# EasyEDA Pro project luq_board.eprj, board 定板，用于打板
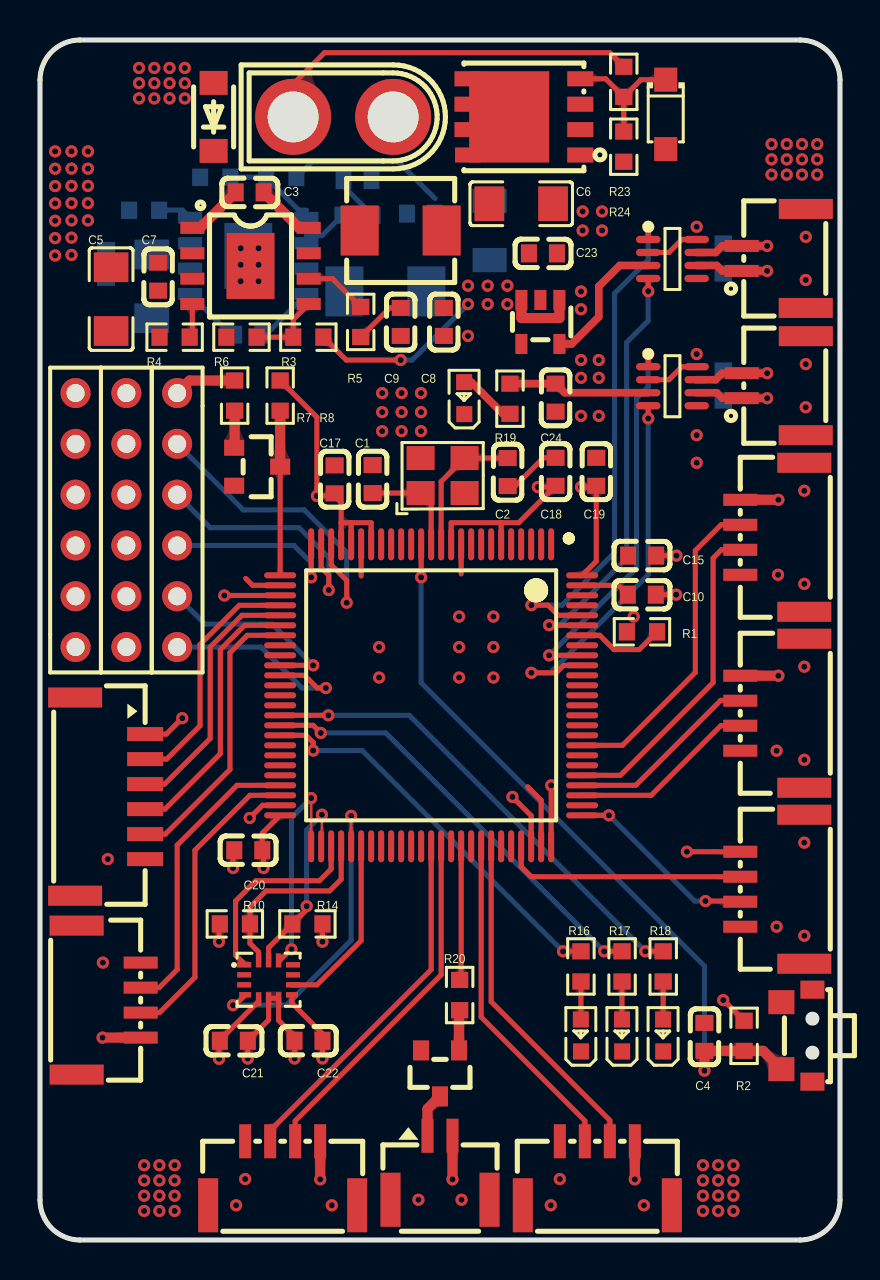
[diagram p3: board, top side]
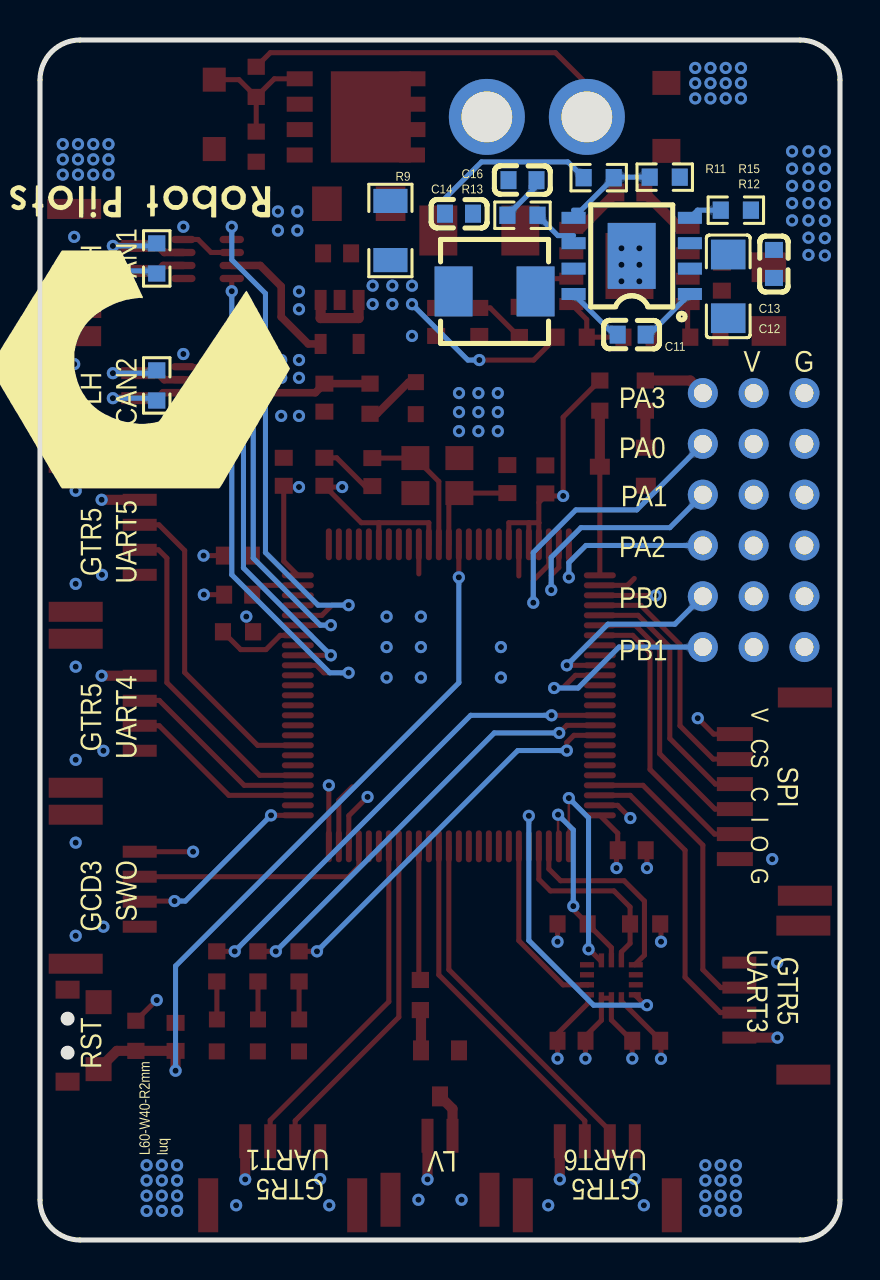
[diagram p4: board, bottom side, seen from below]

Outline 40 x 60 mm; copper layers: Top Layer, vcc, gnd, Bottom Layer. Coordinates in mm from the lower left corner of the outline.
Outline path: 0,58 0,2 arc(0.59,0.59) 2,0 38,0 arc(39.41,0.59) 40,2 40,58 arc(39.41,59.41) 38,60 2,60 arc(0.59,59.41) 0,58
Stack: Top Layer 0.035mm 外层铜厚1oz / Dielectric1 0.2104mm 7628 RC49% 8.6mil / vcc 0.0152mm 内层铜厚 / Dielectric2 1.065mm 1.1mm H/HOZ 含铜 / gnd 0.0152mm 内层铜厚 / Dielectric3 0.2104mm 7628 RC49% 8.6mil / Bottom Layer 0.035mm 外层铜厚1oz

## Design rules (mm)
net CAN2_H: DP2
net CAN2_L: DP2
net CAN1_H: DP1
net CAN1_L: DP1
template: 自定义配置
spacing copperThickness1oz (default): track to track 0.102, other pairs 0.152 to 0.3
spacing copperThickness2oz: track to track 0.203, other pairs 0.152 to 0.3
spacing 6mil: track to track 0.102, other pairs 0.152 to 0.152
track width copperThickness1oz (default): min 0.127, default 0.254, max 2.54
track width copperThickness2oz: min 0.203, default 0.254, max 2.54
track width 10mil: min 0.254, default 0.254, max 2.54
track width 20mil: min 0.508, default 0.508, max 2.54
differential pair differentialPair (default): width min 0.127, default 0.254, max 2.54; gap min 0.152, default 0.152
differential pair err=5mil: width min 0.127, default 0.254, max 2.54; gap min 0.152, default 0.254
via viaSize (default): diameter min 0.5, default 0.61, max 10; hole min 0.3, default 0.305, max 6.299
via 12-24: diameter min 0.5, default 0.61, max 10; hole min 0.3, default 0.305, max 6.299

## Placement (name value [footprint] x y rotation side)
C1  12pF  [C0603]  16.63 38.05 90 top
C2  12pF  [C0603]  23.38 38.4 90 top
C3  100nF  [C0603]  10.48 52.38 180 top
C4  100nF  [C0603]  33.22 10.16 270 top
C5  47uF  [C1206]  3.56 47.04 90 top
C6  47uF  [C1206]  24.06 51.81 180 top
C7  100nF  [C0603]  5.91 48.17 90 top
C8  100nF  [C0603]  20.19 45.9 90 top
C9  3.3nF  [C0603]  18.04 45.9 90 top
C10  10uF  [C0603]  30.09 32.27 180 top
C11  100nF  [C0603]  10.41 45.27 180 bottom
C12  47uF  [C1206]  5.59 47.68 90 bottom
C13  100nF  [C0603]  3.3 48.8 90 bottom
C14  100nF  [C0603]  19.05 51.31 0 bottom
C15  10uF  [C0603]  30.11 34.22 0 top
C16  3.3nF  [C0603]  15.88 52.99 180 bottom
C17  100nF  [C0603]  14.73 38.03 270 top
C18  100nF  [C0603]  25.78 38.41 270 top
C19  100nF  [C0603]  27.81 38.41 270 top
C20  100nF  [C0603]  10.41 19.49 0 top
C21  100nF  [C0603]  9.69 9.96 180 top
C22  100nF  [C0603]  13.42 9.96 0 top
C23  10uF  [C0603]  25.15 49.33 180 top
C24  10uF  [C0603]  25.78 42.12 90 top
CN1  L125WVS-02PW  [CONN-SMD_2P-P1.25_DELON_L125WVS-02PW]  20 3.61 0 top
CN2  XT30U-M  [CONN-TH_XT30U-M]  15.16 56.16 0 top
CN3  GH1.25-2PWBPZ  [CONN-SMD_GH1.25-2PWBPZ]  36.69 49.08 90 top
CN4  GH1.25-2PWBPZ  [CONN-SMD_GH1.25-2PWBPZ]  36.69 42.72 90 top
H1  MF254V-11-06-0743  [HDR-TH_6P-P2.54-V-F_MF254V-11-06-0743]  6.86 36 270 top
H2  MF254V-11-06-0743  [HDR-TH_6P-P2.54-V-F_MF254V-11-06-0743]  4.32 36 90 top
H3  MF254V-11-06-0743  [HDR-TH_6P-P2.54-V-F_MF254V-11-06-0743]  1.78 36 90 top
L1  6.8uH  [IND-SMD_L5.4-W5.2_FXL0530]  18.03 50.47 0 top
L2  6.8uH  [IND-SMD_L5.4-W5.2_FXL0530]  17.27 47.43 0 bottom
LED1  NCD0603R1  [LED0603-RD_RED]  27.05 10.23 90 top
LED2  NCD0603R1  [LED0603-RD_RED]  29.1 10.23 90 top
LED3  NCD0603R1  [LED0603-RD_RED]  31.16 10.23 90 top
LED4  NCD0603G1  [LED0603-RD]  21.21 42.09 90 top
Q1  SS8050  [S8050_SOT-23]  10.86 38.79 180 top
Q2  SS8050  [S8050_SOT-23]  20.13 8.33 90 top
Q3  BSC0702LS  [PG-TDSON-8_L5.0-W6.0-P1.27-BL-EP]  24.2 56.16 90 top
R1  10kΩ  [R0603]  30.1 30.41 180 top
R2  10kΩ  [R0603]  35.21 10.21 90 top
R3  50kΩ  [R0603]  13.42 45.14 0 top
R4  200kΩ  [R0603]  6.73 45.14 0 top
R5  33kΩ  [R0603]  16.03 45.9 90 top
R6  10kΩ  [R0603]  10.07 45.14 0 top
R7  10kΩ  [R0603]  12.01 42.22 90 top
R8  10kΩ  [R0603]  9.73 42.22 90 top
R9  100mΩ  [R1206]  22.48 50.47 270 bottom
R10  10kΩ  [R0603]  9.74 15.8 180 top
R11  50kΩ  [R0603]  12.06 53.12 0 bottom
R12  200kΩ  [R0603]  5.21 51.49 0 bottom
R13  33kΩ  [R0603]  15.88 51.24 180 bottom
R14  10kΩ  [R0603]  13.37 15.8 180 top
R15  10kΩ  [R0603]  8.76 53.14 0 bottom
R16  10kΩ  [R0603]  27.05 13.68 90 top
R17  10kΩ  [R0603]  29.1 13.68 90 top
R18  10kΩ  [R0603]  31.16 13.68 90 top
R19  10kΩ  [R0603]  23.5 42.06 90 top
R20  10kΩ  [R0603]  20.98 12.25 270 top
R21  120Ω  [R0603]  34.16 49.08 270 bottom
R22  120Ω  [R0603]  34.16 42.73 270 bottom
R23  50kΩ  [R0603]  29.19 57.91 90 top
R24  10kΩ  [R0603]  29.19 54.67 90 top
SW1  TS24CA  [SW-SMD_TS24CA]  37.85 10.22 270 top
U1  STM32F407VGT6  [LQFP-100_L14.0-W14.0-P0.50-LS16.0-BL]  19.56 27.23 180 top
U2  GH1.25-4PWBPZ  [CONN-SMD_GH1.25-4PWBPZ]  36.61 35.14 270 top
U3  GH1.25-4PWBPZ  [CONN-SMD_GH1.25-4PWBPZ]  3.43 11.99 90 top
U4  SCT2450QSTER  [ESOP-8_L4.9-W3.9-P1.27-LS6.0-BL-EP]  10.53 48.7 270 top
U5  GH1.25-4PWBPZ  [CONN-SMD_GH1.25-4PWBPZ]  36.61 26.34 270 top
U6  GH1.25-4PWBPZ  [CONN-SMD_GH1.25-4PWBPZ]  27.87 3.34 180 top
U7  SCT2450QSTER  [ESOP-8_L4.9-W3.9-P1.27-LS6.0-BL-EP]  10.41 49.2 90 bottom
U8  GH1.25-4PWBPZ  [CONN-SMD_GH1.25-4PWBPZ]  36.61 17.54 270 top
U9  GH1.25-4PWBPZ  [CONN-SMD_GH1.25-4PWBPZ]  12.13 3.34 180 top
U10  BMI270  [LGA-14_L3.0-W2.5-P0.50-BR]  11.43 13.01 180 top
U11  XC6220B331MR  [SOT-23-5_L2.9-W1.6-P0.95-LS2.8-BR]  25.02 45.9 90 top
U12  HC-GH-6PWT  [CONN-SMD_6P-P1.25_HCTL_HC-GH-6PWT]  3.51 22.17 270 top
U13  MAX3051EKA+T  [SOT-23-8_L3.0-W1.7-P0.65-LS2.8-TL]  31.62 49.05 0 top
U14  SMF22A  [SOD-123FL_L2.8-W1.9-LS3.7-RD]  8.68 56.15 90 top
U15  MAX3051EKA+T  [SOT-23-8_L3.0-W1.7-P0.65-LS2.8-TL]  31.62 42.69 0 top
U16  SMF12A  [SOD-123FL_L2.7-W1.8-LS3.7-RD]  31.29 56.28 270 top
X1  25MHz  [OSC-SMD_4P-L3.2-W2.5-BL]  20.13 38.22 0 top

## Footprints (pads in the part's own frame, mm; a bottom-side part is the same pattern mirrored in y, then rotated)
C0603
  rect 0.8x0.9 smd: 1(-0.7,0) 2(0.7,0)
C1206
  rect 1.485x1.728 smd: 1(-1.593,0) 2(1.593,0)
CONN-SMD_2P-P1.25_DELON_L125WVS-02PW
  rect 0.6x1.7 smd: 1(-0.625,1.6) 2(0.625,1.6)
  rect 1x2.7 smd: 3(2.475,-1.6) 4(-2.475,-1.6)
CONN-SMD_6P-P1.25_HCTL_HC-GH-6PWT
  rect 0.7x1.8 smd: 1(-3.125,1.75) 2(-1.875,1.75) 3(-0.625,1.75) 4(0.625,1.75) 5(1.875,1.75) 6(3.125,1.75)
  rect 1x2.7 smd: 7(4.955,-1.75) 8(-4.955,-1.75)
CONN-SMD_GH1.25-2PWBPZ
  rect 0.6x1.7 smd: 1(-0.625,1.602) 2(0.625,1.602)
  rect 1x2.7 smd: 3(2.475,-1.602) 4(-2.475,-1.598)
CONN-SMD_GH1.25-4PWBPZ
  rect 0.6x1.7 smd: 1(-1.875,-1.601) 2(-0.625,-1.601) 3(0.625,-1.601) 4(1.875,-1.601)
  rect 1x2.7 smd: 5(-3.725,1.601) 6(3.725,1.601)
CONN-TH_XT30U-M
  round 3.8 hole 2.54: 1(-2.5,0) 2(2.5,0)
ESOP-8_L4.9-W3.9-P1.27-LS6.0-BL-EP
  rect 0.6x1.2 smd: 1(-1.905,-2.909) 2(-0.635,-2.909) 3(0.635,-2.909) 4(1.905,-2.909) 5(1.905,2.909) 6(0.635,2.909) 7(-0.635,2.909) 8(-1.905,2.909)
  rect 3.3x2.4 smd: 9(0,0)
HDR-TH_6P-P2.54-V-F_MF254V-11-06-0743
  round 1.5 hole 0.9: 1(-6.35,0) 2(-3.81,0) 3(-1.27,0) 4(1.27,0) 5(3.81,0) 6(6.35,0)
IND-SMD_L5.4-W5.2_FXL0530
  rect 1.9x2.5 smd: 1(-2.05,0) 2(2.05,0)
LED0603-RD
  rect 0.8x0.8 smd: 1(-0.799,-0.004) 2(0.799,0.004)
LED0603-RD_RED
  rect 0.8x0.8 smd: 1(-0.799,-0.004) 2(0.799,0.004)
LGA-14_L3.0-W2.5-P0.50-BR
  rect 0.7x0.27 smd: 1(1.22,-0.75) 2(1.22,-0.25) 3(1.22,0.25) 9(-1.22,0.25) 10(-1.22,-0.25) 11(-1.22,-0.75)
  rect 0.6x0.27 smd: 4(1.17,0.75) 8(-1.17,0.75)
  rect 0.27x0.7 smd: 5(0.5,0.97) 6(0,0.97) 7(-0.5,0.97) 12(-0.5,-0.97) 13(0,-0.97) 14(0.5,-0.97)
LQFP-100_L14.0-W14.0-P0.50-LS16.0-BL
  oval 0.3x1.6 smd: 1(-6,-7.55) 2(-5.5,-7.55) 3(-5,-7.55) 4(-4.5,-7.55) 5(-4,-7.55) 6(-3.5,-7.55) 7(-3,-7.55) 8(-2.5,-7.55) 9(-2,-7.55) 10(-1.5,-7.55) 11(-1,-7.55) 12(-0.5,-7.55) 13(0,-7.55) 14(0.5,-7.55) 15(1,-7.55) 16(1.5,-7.55) 17(2,-7.55) 18(2.5,-7.55) 19(3,-7.55) 20(3.5,-7.55) 21(4,-7.55) 22(4.5,-7.55) 23(5,-7.55) 24(5.5,-7.55) 25(6,-7.55) 51(6,7.55) 52(5.5,7.55) 53(5,7.55) 54(4.5,7.55) 55(4,7.55) 56(3.5,7.55) 57(3,7.55) 58(2.5,7.55) 59(2,7.55) 60(1.5,7.55) 61(1,7.55) 62(0.5,7.55) 63(0,7.55) 64(-0.5,7.55) 65(-1,7.55) 66(-1.5,7.55) 67(-2,7.55) 68(-2.5,7.55) 69(-3,7.55) 70(-3.5,7.55) 71(-4,7.55) 72(-4.5,7.55) 73(-5,7.55) 74(-5.5,7.55) 75(-6,7.55)
  oval 1.6x0.3 smd: 26(7.55,-6) 27(7.55,-5.5) 28(7.55,-5) 29(7.55,-4.5) 30(7.55,-4) 31(7.55,-3.5) 32(7.55,-3) 33(7.55,-2.5) 34(7.55,-2) 35(7.55,-1.5) 36(7.55,-1) 37(7.55,-0.5) 38(7.55,0) 39(7.55,0.5) 40(7.55,1) 41(7.55,1.5) 42(7.55,2) 43(7.55,2.5) 44(7.55,3) 45(7.55,3.5) 46(7.55,4) 47(7.55,4.5) 48(7.55,5) 49(7.55,5.5) 50(7.55,6) 76(-7.55,6) 77(-7.55,5.5) 78(-7.55,5) 79(-7.55,4.5) 80(-7.55,4) 81(-7.55,3.5) 82(-7.55,3) 83(-7.55,2.5) 84(-7.55,2) 85(-7.55,1.5) 86(-7.55,1) 87(-7.55,0.5) 88(-7.55,0) 89(-7.55,-0.5) 90(-7.55,-1) 91(-7.55,-1.5) 92(-7.55,-2) 93(-7.55,-2.5) 94(-7.55,-3) 95(-7.55,-3.5) 96(-7.55,-4) 97(-7.55,-4.5) 98(-7.55,-5) 99(-7.55,-5.5) 100(-7.55,-6)
OSC-SMD_4P-L3.2-W2.5-BL
  rect 1.4x1.2 smd: 1(-1.1,-0.875) 2(1.1,-0.875) 3(1.1,0.875) 4(-1.1,0.875)
PG-TDSON-8_L5.0-W6.0-P1.27-BL-EP
  rect 0.75x1.3 smd: 1(-1.905,-2.82) 2(-0.635,-2.82) 3(0.635,-2.82) 4(1.905,-2.82) 5(1.905,2.82) 6(0.635,2.82) 7(-0.635,2.82) 8(-1.905,2.794)
  rect 4.56x4 smd: 8(0,0.737)
R0603
  rect 0.806x0.864 smd: 1(-0.753,0) 2(0.753,0)
R1206
  rect 1.208x1.701 smd: 1(-1.479,0) 2(1.479,0)
S8050_SOT-23
  rect 1x0.8 smd: 1(1.15,-0.823) 2(1.15,1.077) 3(-1.15,0.127)
SOD-123FL_L2.7-W1.8-LS3.7-RD
  rect 1.2x1.15 smd: 1(-1.735,0) 2(1.735,0)
SOD-123FL_L2.8-W1.9-LS3.7-RD
  rect 1.2x1.4 smd: 1(-1.7,0) 2(1.7,0)
SOT-23-5_L2.9-W1.6-P0.95-LS2.8-BR
  rect 1x0.6 smd: 1(1.1,-0.95) 2(1.1,0) 3(1.1,0.95) 4(-1.1,0.95) 5(-1.1,-0.95)
SOT-23-8_L3.0-W1.7-P0.65-LS2.8-TL
  oval 1.222x0.364 smd: 1(-1.211,0.975) 2(-1.211,0.325) 3(-1.211,-0.325) 4(-1.211,-0.975) 5(1.211,-0.975) 6(1.211,-0.325) 7(1.211,0.325) 8(1.211,0.975)
SW-SMD_TS24CA
  rect 0.9x1.2 smd: 1(-2.3,0.775) 2(2.3,0.775)
  rect 1.2x1.3 smd: 3(-1.675,-0.775) 4(1.675,-0.775)

## Nets
As in the schematic.

Pads without a net: U1 1 2 3 4 5 7 8 9 15 16 17 18 33 34 37 38 39 43 44 45 46 57 58 59 60 61 62 65 67 70 71 77 81 82 84 85 86 87 88 89 90 93 97 98; U4 3; U7 3; U10 2 3 10 11; U11 4; U13 5; U15 5

## Via types
v1: diameter 0.61, hole 0.305, Top Layer to Bottom Layer, 197 vias

## Routing (per net, layer and track width the routed paths; a pad name or vN(x,y) marks a point on that pad's centre or on a via; arc(x,y) is an arc through that point)
+3.3V: length 77.5
  Top Layer w0.254: U1.19 16.56,35.86 15.56,35.86 ; v1(7.11,26.09) 6.32,25.3 U12.1 ; 15.06,35.86 15.06,36.88 14.73,37.2 v1(13.84,37.2) 13.84,41.14 R7.2 ; 15.06,35.86 U1.22 ; 15.06,35.86 15.06,35.86 15.56,35.86 ; R10.2 8.95,15.76 v1(8.95,14.92) ; U1.21 15.56,35.86 ; U8.1 v1(32.35,19.41) ; v1(25.56,22.73) U1.75 ; 23.06,35.86 23.93,35.86 25.72,37.65 ; 23.06,35.86 20.56,35.86 U1.11 ; 23.06,35.86 U1.6 ; v1(24.89,37.65) 25.72,37.65 ; 25.72,37.65 C18.2 ; v1(14.12,9.07) 14.12,10.32 12.6,11.84 U10.8 ; 10.93,12.09 10.93,11.94 8.95,9.96 v1(8.95,9.06) ; U1.28 12,32.23 v1(9.21,32.23) ; v1(11.18,18.6) 11.18,19.42 C20.2 11.11,20.34 U1.50 ; 35.21,10.96 34.17,11.99 v1(34.16,11.99) ; U1.100 27.81,33.94 C19.2 27.75,37.65 v1(27.05,37.65) ; v1(14.12,14.92) R14.1
  Top Layer w0.381: U13.3 28.99,48.73 27.94,47.68 27.94,46.16 26.59,44.8 U11.5 ; U15.3 26.23,42.36 C24.2 R19.2
  vcc w0.254: v1(32.35,19.41) 32.35,13.81 v1(34.16,11.99) ; v1(7.11,26.09) 9.53,26.09
  vias: v1(27.05,47.43) v1(27.05,46.54) v1(27.05,44) v1(27.05,43.11) v1(27.94,44) v1(27.94,43.11)
+5V: length 24.3
  Top Layer w0.254: R3.2 15.31,44 v1(18.03,44)
  Top Layer w0.508: v1(14.01,3.03) U9.1 ; v1(20.62,3.03) CN1.2 ; 24.07,47 24.07,46.1 25.97,46.1 U11.1 ; 35.01,37.01 v1(36.92,37.01) ; v1(29.74,3.03) U6.1 ; U5.1 v1(36.92,28.21) ; v1(3.13,10.12) U3.1
  Bottom Layer w0.254: v1(21.4,46.79) 18.61,44 v1(18.03,44)
  vias: v1(21.4,47.72) v1(22.38,47.72) v1(22.38,46.79) v1(23.37,47.72) v1(23.37,46.79)
+5V_PWM: length 8
  Bottom Layer w0.254: R11.2 13.6,53.9 17.92,53.9 19.75,52.08
+24V: length 19.1
  Top Layer w0.254: CN2.1 12.66,57.8 14.22,59.36 28.49,59.36 R23.2
  vias: v1(0.76,54.43) v1(0.76,53.56) v1(0.76,52.7) v1(0.76,51.83) v1(0.76,50.96) v1(0.76,50.09) v1(0.76,49.23) v1(1.58,54.43) v1(1.58,53.57) v1(1.58,52.7) v1(1.58,51.84) v1(1.58,50.98) v1(1.58,50.12) v1(1.58,49.25) v1(2.4,54.43) v1(2.4,53.57) v1(2.4,52.7) v1(2.4,51.84) v1(2.4,50.98)
GND: length 27
  Top Layer w0.254: C2.1 23.75,37.7 25.17,39.11 25.53,39.11 ; U15.8 32.1,43.66 31.45,43.01 U15.2 ; 10.29,33.08 10.63,32.73 U1.27 ; U1.99 28.92,32.73 C10.2 ; 24.38,22.66 25.06,21.99 U1.74 ; U13.8 32.1,50.03 31.45,49.38 U13.2 ; v1(10.39,9.07) 10.39,9.08 C21.1 11.43,11 11.43,12.09 11.93,12.09 11.93,10.99 12.73,10.19 v1(12.73,9.07) ; U1.20 16.06,33.2 ; C20.1 9.65,19.42 v1(9.65,18.6) ; U1.10 21.06,33.31
  vias: v1(3.15,13.87) v1(3.39,19.05) v1(4.95,58.6) v1(4.95,57.84) v1(4.95,57.08) v1(5.21,3.74) v1(5.21,2.98) v1(5.21,2.22) v1(5.21,1.45) v1(5.72,58.6) v1(5.72,57.84) v1(5.72,57.08) v1(5.97,3.74) v1(5.97,2.98) v1(5.97,2.22) v1(5.97,1.45) v1(6.48,58.6) v1(6.48,57.84) v1(6.48,57.08) v1(6.73,3.74) v1(6.73,2.98) v1(6.73,2.22) v1(6.73,1.45) v1(7.24,58.6) v1(7.24,57.84) v1(7.24,57.08) v1(9.81,1.74) v1(10.03,49.59) v1(10.03,48.76) v1(10.03,47.94) v1(10.26,3.05) v1(10.93,49.59) v1(10.93,48.76) v1(10.93,47.94) v1(14.59,1.74) v1(16.95,29.65) v1(16.95,28.12) v1(17.11,42.35) v1(17.11,41.39) v1(17.11,40.44) v1(18.08,42.35) v1(18.08,41.39) v1(18.08,40.44) v1(18.92,2.01) v1(19.05,42.35) v1(19.05,41.39) v1(19.05,40.44) v1(20.96,31.17) v1(20.96,29.65) v1(20.96,28.12) v1(21.08,2.01) v1(21.4,45.2) v1(22.67,31.17) v1(22.67,29.65) v1(22.67,28.12) v1(25.54,1.74) v1(25.99,3.05) v1(27.13,51.43) v1(27.13,50.47) v1(27.05,41.2) v1(27.94,41.2) v1(28.1,51.43) v1(28.1,50.47) v1(29.69,31.17) v1(30.19,1.74) v1(32.83,50.66) v1(32.83,44.3) v1(32.83,40.24) v1(32.83,38.86) v1(33.15,3.74) v1(33.15,2.98) v1(33.15,2.22) v1(33.15,1.45) v1(33.91,3.74) v1(33.91,2.98) v1(33.91,2.22) v1(33.91,1.45) v1(34.67,3.74) v1(34.67,2.98) v1(34.67,2.22) v1(34.67,1.45) v1(36.58,54.79) v1(36.58,54.03) v1(36.58,53.27) v1(36.83,24.46) v1(36.83,15.66) v1(36.9,33.26) v1(37.34,54.79) v1(37.34,54.03) v1(37.34,53.27) v1(38.1,54.79) v1(38.1,54.03) v1(38.1,53.27) v1(38.22,37.46) v1(38.22,32.81) v1(38.22,28.67) v1(38.22,24.01) v1(38.22,19.87) v1(38.22,15.21) v1(38.29,50.16) v1(38.29,48) v1(38.29,43.79) v1(38.29,41.64) v1(38.86,54.79) v1(38.86,54.03) v1(38.86,53.27)
$C3_1: length 3
  Top Layer w0.508: 13.43,50.61 12.96,50.61 C3.1
$C3_2: length 2.9
  Top Layer w0.508: U4.1 8.01,50.61 9.78,52.38
$C9_2: length 2.6
  Top Layer w0.254: R5.1 17.49,46.6 18.03,46.6
$C10_1: length 17.4
  Top Layer w0.254: v1(23.62,22.15) 24.56,21.22 U1.73 ; v1(31.81,32.27) C10.1
  vcc w0.254: v1(23.62,22.15) 31.81,30.34 v1(31.81,32.27)
$C11_1: length 3.1
  Bottom Layer w0.254: U7.8 11.29,45.27 C11.1
$C11_2: length 3.1
  Bottom Layer w0.254: U7.1 9.54,45.27 C11.2
$C15_2: length 29.6
  Top Layer w0.254: U1.49 11.12,21.73 v1(10.48,21.1) ; v1(31.82,34.22) 30.81,34.22
  vcc w0.254: v1(31.82,34.22) 20.77,23.17 12.56,23.17 v1(10.48,21.1)
$C16_2: length 2.5
  Bottom Layer w0.254: R13.1 15.18,52.69 15.18,53.12
$CN1_1: length 2.2
  Top Layer w0.508: Q2.3 19.38,6.56 CN1.1
$LED1_2: length 1.9
  Top Layer w0.254: R16.1 27.05,11.03 LED1.2
$LED2_2: length 1.9
  Top Layer w0.254: R17.1 29.1,12.92 LED2.2
$LED3_2: length 1.9
  Top Layer w0.254: LED3.2 31.16,12.92 R18.1
$LED4_2: length 2.9
  Top Layer w0.381: LED4.2 21.56,42.89 23.15,41.31 23.5,41.31
$Q1_1: length 1.9
  Top Layer w0.254: 9.73,39.64 Q1.1
  Top Layer w0.508: R8.1 9.73,39.64
$Q2_1: length 2
  Top Layer w0.508: R20.2 20.95,11.46 Q2.1
$Q3_4: length 6.7
  Top Layer w0.254: U16.1 30.05,58.02 29.19,57.16 ; 29.19,57.16 R24.2 ; 29.19,57.16 28.28,58.06 Q3.4
$R1_1: length 4.4
  Top Layer w0.254: R1.1 29.96,29.52 28.7,29.52 27.99,30.23 U1.94
$R3_1: length 3.8
  Top Layer w0.254: 13.43,46.8 12.66,46.03 R3.1 R6.2
$R4_2: length 1.7
  Top Layer w0.254: U4.4 7.62,45.27 R4.2
$R5_2: length 3.2
  Top Layer w0.254: R5.2 14.62,48.07 13.43,48.07
$R11_1: length 4.5
  Bottom Layer w0.254: R15.2 11.29,53.14 R11.1 12.94,51.49 13.32,51.49
$R12_2: length 1.7
  Bottom Layer w0.254: R12.2 7.12,51.49 U7.4
$R13_2: length 2.2
  Bottom Layer w0.254: 13.32,50.22 14.11,50.22 R13.2
ADC1_IN8: length 9.9
  Top Layer w0.254: v1(13.66,28.73) U1.35
  Bottom Layer w0.254: H1.5 8.25,30.79 11.6,30.79 v1(13.66,28.73)
ADC1_IN9: length 10.8
  Top Layer w0.254: U1.36 13.23,28.23 13.86,27.6 v1(14.29,27.6)
  Bottom Layer w0.254: v1(14.29,27.6) 13.1,27.6 11.05,29.65 H1.6
CAN1_H: length 5.9
  Top Layer w0.381: v1(36.36,49.7) CN3.2 34.11,49.7 33.78,49.38 U13.7
  Bottom Layer w0.254: v1(36.36,49.7) 34.29,49.7 R21.1
CAN1_L: length 5.9
  Top Layer w0.381: v1(36.36,48.45) CN3.1 34.11,48.45 33.84,48.73 U13.6
  Bottom Layer w0.254: R21.2 34.29,48.45 v1(36.36,48.45)
CAN1_RX: length 21.4
  Top Layer w0.254: v1(25.46,30.74) 25.47,30.73 U1.95 ; U13.4 v1(30.41,47.44)
  Bottom Layer w0.254: v1(25.46,30.74) 25.99,30.74 29.34,34.09 29.34,44.89 30.41,45.96 v1(30.41,47.44)
CAN1_TX: length 25.6
  Top Layer w0.254: U1.96 25.91,31.23 25.4,31.74 v1(24.57,31.74) ; U13.1 v1(30.41,50.66)
  Bottom Layer w0.254: v1(30.41,50.66) 30.41,49.01 28.73,47.33 28.73,34.37 26.1,31.74 v1(24.57,31.74)
CAN2_H: length 5.9
  Top Layer w0.381: v1(36.36,43.34) CN4.2 34.11,43.34 33.78,43.01 U15.7
  Bottom Layer w0.254: R22.1 34.3,43.34 v1(36.36,43.34)
CAN2_L: length 5.9
  Top Layer w0.381: v1(36.36,42.09) 34.11,42.09 33.84,42.36 U15.6
  Bottom Layer w0.254: R22.2 34.28,42.09 v1(36.36,42.09)
CAN2_RX: length 19
  Top Layer w0.254: v1(30.41,41.08) U15.4 ; U1.91 26.18,28.73 25.81,28.36 v1(24.57,28.36)
  Bottom Layer w0.254: v1(30.41,41.08) 30.41,33.26 25.51,28.36 v1(24.57,28.36)
CAN2_TX: length 19.4
  Top Layer w0.254: v1(30.41,44.3) U15.1 ; v1(25.46,29.23) U1.92
  Bottom Layer w0.254: v1(25.46,29.23) 29.83,33.6 29.83,42.08 30.41,42.66 v1(30.41,44.3)
INT_1: length 15.8
  Top Layer w0.127: v1(15.56,21.21) U1.55
  Top Layer w0.254: v1(9.65,11.74) 9.74,11.74 U10.4
  Bottom Layer w0.254: v1(9.65,11.74) 12.32,11.74 15.56,14.98 v1(15.56,21.21)
INT_2: length 9.1
  Top Layer w0.254: 12.6,12.76 12.6,12.76 13.84,12.76 16.06,14.97 U1.56
LASER: length 6.7
  Top Layer w0.254: U1.66 21.06,13.08 R20.1
LED_B: length 19.7
  Top Layer w0.254: U1.42 13.3,25.23 13.66,24.88 v1(13.66,24.47) ; v1(26.15,14.43) R16.2
  Bottom Layer w0.254: v1(26.15,14.43) 16.11,24.47 v1(13.66,24.47)
LED_G: length 21.8
  Top Layer w0.254: U1.41 13.66,25.73 v1(14.04,25.35) ; v1(28.21,14.43) R17.2
  Bottom Layer w0.254: v1(28.21,14.43) 17.29,25.35 v1(14.04,25.35)
LED_R: length 24
  Top Layer w0.254: U1.40 v1(14.42,26.23) ; v1(30.27,14.43) R18.2
  Bottom Layer w0.254: v1(14.42,26.23) 18.46,26.23 v1(30.27,14.43)
NRST: length 37.4
  Top Layer w0.254: U1.14 v1(19.06,33.13)
  Top Layer w0.508: v1(33.22,8.46) C4.2 R2.1 36.16,9.46 SW1.4
  Bottom Layer w0.254: v1(19.06,33.13) 19.06,27.86 33.22,13.7 v1(33.22,8.46)
OSC_1: length 6.9
  Top Layer w0.254: U1.12 20.06,37.92 X1.3 C2.2
OSC_2: length 5.2
  Top Layer w0.254: U1.13 19.56,36.82 X1.1 C1.1
PA3: length 3.1
  Top Layer w0.508: H1.1 7.48,42.97 R8.2
SPI1_CS: length 12.3
  Top Layer w0.254: 5.26,24.05 6.34,24.05 8,25.71 8,29.77 9.96,31.73 U1.29
SPI1_MISO: length 13.6
  Top Layer w0.254: U12.4 6.25,21.55 9.02,24.31 9.02,29.52 10.23,30.73 U1.31
SPI1_MOSI: length 14.3
  Top Layer w0.254: U12.5 6.27,20.3 9.5,23.53 9.5,29.37 10.37,30.23 U1.32
SPI1_SCK: length 12.9
  Top Layer w0.254: U12.3 6.23,22.8 8.51,25.08 8.51,29.65 10.1,31.23 U1.30
SPI2_CS: length 11.3
  Top Layer w0.127: v1(13.56,22.1) U1.51
  Top Layer w0.254: 11.93,13.93 11.94,13.93 12.54,14.53 v1(12.57,14.53)
  Bottom Layer w0.254: v1(13.56,22.1) 12.57,21.11 v1(12.57,14.53)
SPI2_MISO: length 10
  Top Layer w0.254: U1.53 14.56,18.55 13.97,17.96 10.79,17.96 9.78,16.95 9.78,14.24 10.26,13.76
SPI2_MOSI: length 9.7
  Top Layer w0.254: 10.93,13.93 10.93,14.4 10.5,14.83 10.5,16.65 11.3,17.45 14.48,17.45 15.06,18.03 U1.54
SPI2_SCLK: length 10
  Top Layer w0.127: v1(14.1,21.27) 14.1,19.72 U1.52
  Top Layer w0.254: 11.43,13.93 11.43,14.62 R14.2 13.34,16.52 v1(13.34,16.69)
  Bottom Layer w0.254: v1(14.1,21.27) 13.34,20.5 v1(13.34,16.69)
SWCLK: length 9.7
  Top Layer w0.254: U1.76 v1(28.45,21.23) ; U8.3 34.98,16.95 v1(33.27,16.95)
  Bottom Layer w0.254: v1(33.27,16.95) 32.74,16.95 v1(28.45,21.23)
SWDIO: length 12.2
  Top Layer w0.254: U1.72 24.06,18.67 24.56,18.16 U8.2
TIM2_1: length 16.5
  Top Layer w0.254: v1(15.34,31.86) 15.34,32.98 14.56,33.76 U1.23
  Bottom Layer w0.254: v1(15.34,31.86) 15.34,34.38 13.21,36.5 10.16,36.5 H1.2
TIM5_2: length 13
  Top Layer w0.254: v1(14.44,32.5) 14.44,33.24 14.06,33.62 U1.24
  Bottom Layer w0.254: v1(14.44,32.5) 14.44,34.13 12.95,35.62 8.51,35.62 H1.3
TIM5_3: length 9.4
  Top Layer w0.254: v1(13.56,33.13) U1.25
  Bottom Layer w0.254: v1(13.56,33.13) 13.56,33.87 12.7,34.73 H1.4
UART1_R: length 17.2
  Top Layer w0.254: U6.2 28.49,5.98 22.56,11.91 U1.69
UART1_T: length 16.9
  Top Layer w0.254: U1.68 22.06,11.15 27.24,5.96 U6.3
UART3_R: length 15.2
  Top Layer w0.254: U1.48 10.49,22.23 7.75,19.49 7.75,13.14 5.98,11.37 U3.2
UART3_T: length 14.8
  Top Layer w0.254: U3.3 5.96,12.62 6.86,13.52 6.86,19.74 9.85,22.73 U1.47
UART4_R: length 9.7
  Top Layer w0.254: U1.79 29.79,22.73 34.04,26.98 35,26.98 U5.2
UART4_T: length 9.3
  Top Layer w0.254: U1.78 30.56,22.23 34.04,25.71 U5.3
UART5_R: length 16
  Top Layer w0.254: U2.2 34.05,35.76 32.77,34.47 32.77,28.38 29.12,24.73 U1.83
UART5_T: length 16.2
  Top Layer w0.254: U2.3 34.07,34.51 33.66,34.09 33.66,27.87 29.02,23.23 U1.80
UART6_R: length 17.8
  Top Layer w0.254: U9.2 12.76,5.96 20.06,13.26 U1.64
UART6_T: length 18.1
  Top Layer w0.254: U9.3 11.51,5.47 19.56,13.52 U1.63
USART2_RX: length 8.2
  Top Layer w0.254: Q1.3 U1.26
  Top Layer w0.508: R7.1 Q1.3

## Copper pours and planes (outline as drawn; the poured copper is in the pictures)
+3.3V on Top Layer: 25.02,42.12 29.46,42.12 29.46,48.95 26.54,48.95 26.54,45.39 25.02,45.39
+3.3V on vcc: 33.02,48.95 33.02,18.62 8.13,18.62 8.13,42.12 25.02,42.12 25.02,48.95
+3.3V on vcc: 8.13,20.12 14.99,20.12 14.99,8.56 8.13,8.56
+5V on Top Layer: 19.18,46.18 24.36,46.18 24.36,52.91 19.18,52.91
+5V on Bottom Layer: 21.5,50.87 24.4,50.87 24.4,46.22 20.86,46.22 20.86,50.24
+5V on vcc: 24.36,52.91 19.18,52.91 19.18,46.18 -4.06,46.18 -4.06,-4.9 42.93,-4.9 42.93,39.14 35.01,39.14 35.01,10.88 29.07,4.94 10.5,4.94 5.59,9.85 5.59,43.62 24.36,43.62
+5V_PWM on Bottom Layer: 18.41,44.83 18.41,49.94 19.33,50.86 19.33,52.79 23.56,52.79 23.56,51.43 21.37,51.43 19.97,50.03 19.97,44.83
+24V on Top Layer: -0.89,55.05 -0.89,48.44 8.48,48.44 8.48,49.71 6.91,49.71 6.53,50.09 6.53,51.01 9.08,53.56 14.83,53.56 14.86,53.52 14.86,60.7 9.81,60.7 9.81,55.58 9.27,55.05
+24V on Bottom Layer: -0.89,55.05 2.85,55.05 2.85,48.83 -0.89,48.83
+24V on Bottom Layer: 8.13,48.23 8.13,48.97 6.68,48.97 6.68,50.63 -0.63,50.63 -0.63,48.83 4.5,48.83 4.5,48.23
+24V on vcc: -6.8,61.04 -6.8,48.44 14.78,48.44 14.78,61.04
GND on Top Layer: -32.51,92.77 76.71,92.77 76.71,-44.78 -32.51,-44.78
GND on Bottom Layer: -10.41,66.35 49.4,66.35 49.4,-8.58 -10.41,-8.58
GND on gnd: -24.38,82.1 72.01,82.1 72.01,-25.98 -24.38,-25.98
PGND on Top Layer: 15.42,61.77 15.42,53.56 25.47,53.56 25.47,61.77
$C3_1 on Top Layer: 16.99,48.86 16.99,53.08 14.35,53.08 14.35,50.98 12.96,50.98 12.96,50.25 14.35,50.25 14.35,48.86
$C11_1 on Bottom Layer: 14.57,50.03 14.57,48.91 13.81,47.68 12.7,47.68 12.7,46.92 14.16,46.92 14.57,45.95 14.57,44.83 16.03,44.83 16.03,50.03

Small or netless copper shapes (teardrops, artwork), in the pictures only: 238 on Top Layer, 56 on Bottom Layer, 7 on vcc

## Text on the board
Bottom Silkscreen Layer: L60-W40-R2mm / luq | V | I | CS | C | O | G | PA1 | PA0 | PA2 | PB0 | PB1 | PA3 | UART6 | GTR5 | UART1 | CAN1 | CAN2 | LH | GCD3 | RST | SPI | UART3 | UART4 | LV | SWO | UART5
Document Layer: 稳定版本不作修改
